# EasyEDA Pro project ProProject_Kame Quadrapot_2024-12-26.epro, board PCB1
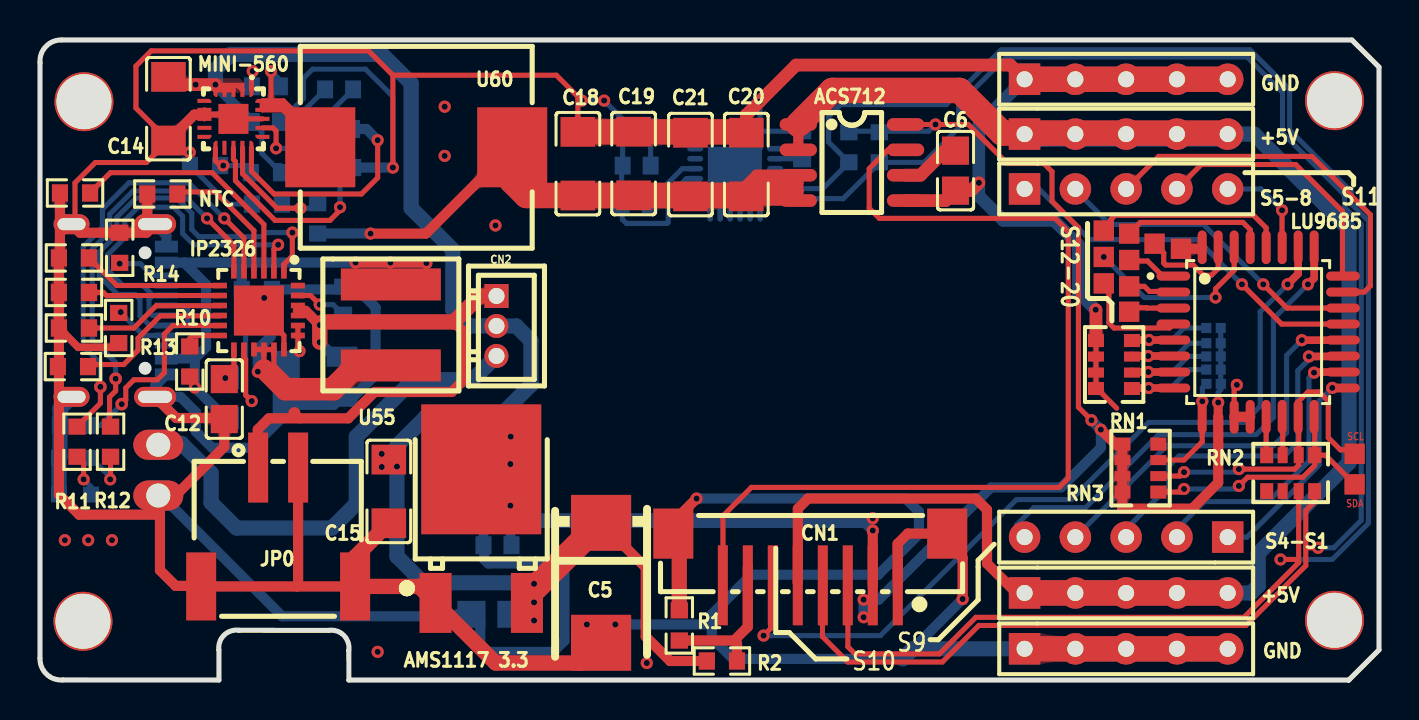
[diagram p7: board, top side]
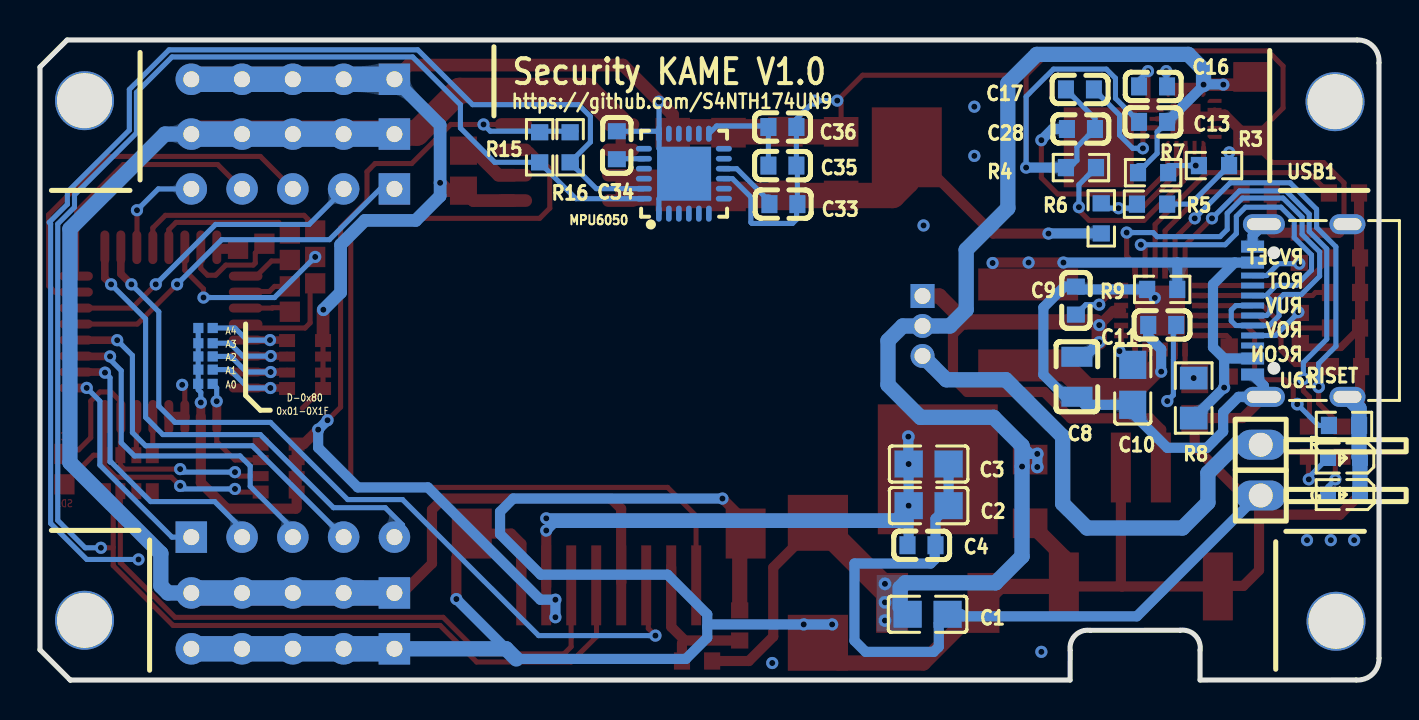
[diagram p8: board, bottom side, seen from below]

Outline 66.98 x 32.03 mm; copper layers: Top Layer, Bottom Layer. Coordinates in mm from the lower left corner of the outline.
Outline path: 65.47,0 15.45,0 15.45,1.49 arc(15.2,2.24) 14.45,2.49 9.95,2.49 arc(9.2,2.24) 8.95,1.49 8.95,0 1.14,0 arc(0.33,0.29) 0,1.09 0,30.89 arc(0.29,31.7) 1.09,32.03 65.62,32.03 66.98,30.67 66.98,1.51 65.47,0 ; 65.47,0 65.44,0
Stack: Top Layer 0.035mm / Dielectric1 1.51mm FR4 er 4.5 / Bottom Layer 0.035mm

## Design rules (mm)
template: Custom Config
spacing copperThickness1oz (default): track to track 0.102, other pairs 0.051 to 0.3
spacing copperThickness2oz: track to track 0.203, other pairs 0.152 to 0.3
track width copperThickness1oz (default): min 0.127, default 0.254, max 2.54
track width copperThickness2oz: min 0.203, default 0.254, max 2.54
differential pair differentialPair (default): width min 0.127, default 0.254, max 2.54; gap min 0.152, default 0.152
via viaSize (default): diameter min 0.5, default 0.61, max 10; hole min 0.3, default 0.305, max 6.299

## Placement (name value [footprint] x y rotation side)
+5V  -  [HDR-5X1/2.54]  54.33 4.36 0 top
+5V#2  -  [HDR-5X1/2.54]  54.33 27.32 0 top
ACS712  ACS712ELCTR-05B-T-JSM  [SOP-8_L4.9-W3.9-P1.27-LS6.0-BL]  40.61 25.9 270 top
AMS1117 3.3  AMS1117-3.3  [TO-252-3_L6.6-W6.1-P4.58-LS10.1-BR]  22.07 7.2 270 top
C1  106  [C0805]  22.58 3.29 0 bottom
C2  106  [C0805]  22.53 8.73 0 bottom
C3  106  [C0805]  22.53 10.81 0 bottom
C4  104  [C0603]  22.88 6.74 0 bottom
C5  33uF  [CASE-D_7343]  28.07 4.86 90 top
C6  1nF  [C0805]  45.8 25.49 270 top
C8  10uF  [C0805#2]  15.11 15.18 270 bottom
C9  0.1pF  [C0603]  15.16 18.99 270 bottom
C10  22uF  [C0805]  12.32 14.77 270 bottom
C11  100nF  [C0603]  10.84 17.77 180 bottom
C12  10uF  [C0805]  9.22 14.06 90 top
C13  10nF  [C0603]  11.3 27.93 180 bottom
C14  4.7uF  [C1206]  6.43 28.59 90 top
C15  4.7uF  [C1206]  17.45 9.44 90 top
C16  1nF  [C0603]  11.3 29.71 0 bottom
C17  1nF  [C0603]  14.96 29.55 0 bottom
C18  4.7uF  [C1206]  26.9 25.84 270 top
C19  4.7uF  [C1206]  29.69 25.84 270 top
C20  4.7uF  [C1206]  35.33 25.79 270 top
C21  4.7uF  [C1206]  32.54 25.79 270 top
C28  1nF  [C0603]  14.91 27.57 180 bottom
C33  1u  [C0603]  29.79 23.81 180 bottom
C34  1u  [C0603]  38.12 26.76 90 bottom
C35  10u  [C0603]  29.84 25.74 0 bottom
C36  1u  [C0603]  29.84 27.67 0 bottom
CN1  8PIN_SMT(1.25MM)  [CONN-SMD_8PIN_SMT-P1.25]  38.53 6.03 180 top
CN2  HDR-1X2  [CONN-TH_3P-P1.50_ZH1.5-3A]  22.83 17.72 270 top
G  LedRed_0603  [LED0603-RD_RED]  1.75 9.28 0 bottom
GND  -  [HDR-5X1/2.54]  54.33 1.56 0 top
GND#2  -  [HDR-5X1/2.54]  54.33 30.06 0 top
IP2326  IP2326_NPD  [QFN-24_L4.0-W4.0-P0.50-BL-EP2.5]  10.95 18.49 180 top
JP0  HDR-1X2  [CONN-SMD_PH2.0MM-2AWB]  11.91 7.66 0 top
LU9685  LU9685-20CU  [LQFP-32_L7.0-W7.0-P0.80-LS9.0-BL]  60.93 17.41 270 top
MINI-560  -  [VQFN-20_L3.0-W3.0-P0.45-TL-EP]  9.68 28.08 270 top
MPU6050  MPU6050-YJLTY  [QFN-24_L4.0-W4.0-P0.50-BL-EP2.7]  34.77 25.34 180 bottom
NOREF  -  [Pad_e2335]  53.21 21.17 180 top
NOREF#2  -  [Pad_e2310]  54.48 22.34 180 top
NOREF#3  -  [Pad_e13529]  59.06 15.53 180 top
NOREF#4  -  [Pad_e13526]  59.06 14.82 180 top
NOREF#5  -  [Pad_e13535]  59.06 17.62 180 top
NOREF#6  -  [Pad_e2339]  54.48 18.43 180 top
NOREF#7  -  [Pad_e13532]  58.34 16.85 180 top
NOREF#8  -  [Pad_e13533]  59.06 16.85 180 top
NOREF#9  -  [Pad_e13531]  59.06 16.19 180 top
NOREF#10  -  [Pad_e2297]  53.21 22.49 180 top
NOREF#11  -  [Pad_e2321]  55.75 21.83 180 top
NOREF#12  -  [Pad_e77]  64.75 28.99 0 top
NOREF#13  -  [Pad_e13530]  58.34 16.19 180 top
NOREF#14  -  [Pad_e2405]  12.72 13.35 0 top
NOREF#15  -  [Pad_e2336]  54.48 21.02 180 top
NOREF#16  -  [Pad_e2377]  65.76 11.32 180 top
NOREF#17  -  [Pad_e2337]  53.21 19.85 180 top
NOREF#18  -  [Pad_e73]  2.15 2.94 0 top
NOREF#19  -  [Pad_e2322]  57.07 21.58 180 top
NOREF#20  -  [Pad_e2338]  54.48 19.7 180 top
NOREF#21  -  [Pad_e13528]  58.34 15.53 180 top
NOREF#22  -  [Pad_e13534]  58.34 17.62 180 top
NOREF#23  -  [Pad_e71]  2.2 28.94 0 top
NOREF#24  -  [Pad_e2378]  65.76 9.79 180 top
NOREF#25  -  [Pad_e75]  64.75 2.99 0 top
NOREF#26  -  [Pad_e13525]  58.34 14.82 180 top
NTC  5.1kΩ  [R0603]  6.12 24.32 0 top
R  LedGreen_0603  [LED0603-RD_GREEN]  1.75 11.11 0 bottom
R1  10kΩ  [R0603]  31.98 2.73 90 top
R2  15kΩ  [R0603]  34.11 0.95 0 top
R3  5.1kΩ  [R0603]  8.25 25.74 0 bottom
R4  5.1kΩ  [R0603]  14.91 25.64 180 bottom
R5  8.1kΩ  [R0603]  11.35 23.81 0 bottom
R6  8.5kΩ  [R0603]  13.89 23.1 270 bottom
R7  5.1kΩ  [R0603]  11.3 25.39 180 bottom
R8  0.56  [R0805]  9.27 14.11 270 bottom
R9  5.1kΩ  [R0603]  10.84 19.55 180 bottom
R10  5.1kΩ  [R0603]  7.49 15.94 90 top
R11  1kΩ  [R0603]  1.85 11.93 90 top
R12  1kΩ  [R0603]  3.53 11.93 90 top
R13  5.1kΩ  [R0603]  3.94 17.62 90 top
R14  5.1kΩ  [R0603]  3.99 21.63 270 top
R15  2.2K  [R0603]  41.99 26.66 90 bottom
R16  2.2K  [R0603]  40.46 26.66 90 bottom
RCON  1k  [R0603]  1.65 15.68 0 top
RISET  75k  [R0603]  1.75 12.74 0 bottom
RN1  4.7kΩ  [RES-ARRAY-SMD_0603-8P-L3.2-W1.6-BL]  53.72 15.79 270 top
RN2  220Ω  [RES-ARRAY-SMD_0603-8P-L3.2-W1.6-BL]  62.56 10.35 0 top
RN3  4.7kΩ  [RES-ARRAY-SMD_0603-8P-L3.2-W1.6-BL]  55.04 10.6 270 top
ROT  120K  [R0603]  1.7 21.12 0 top
ROV  NC  [R0603]  1.7 17.62 0 top
RUV  1k  [R0603]  1.7 19.39 0 top
RVSET  NC  [R0603]  1.75 24.37 180 top
S4-S1  2.54mm 1*5p Female header  [HDR-5X1/2.54]  54.33 7.15 180 top
S5-8  2.54mm 1*5p Female header  [HDR-5X1/2.54]  54.33 24.57 0 top
U55  2.2uH  [IND-SMD_L6.7-W6.5]  17.55 17.77 90 top
U60  BCIHP1040SC-R15M  [IND-SMD_L11.6-W10.1]  18.82 26.66 0 top
U61  PH2.0-2P  [2.54mm_1*2P_oval]  5.92 9.23 0 bottom
USB1  TYPEC-304A-ACP16O  [USB-SMD_TYPEC-304A-ACP16O]  3.95 18.49 90 bottom

## Footprints (pads in the part's own frame, mm; a bottom-side part is the same pattern mirrored in y, then rotated)
2.54mm_1*2P_oval
  oval 2.5x1.5 hole 1.2: 1(0,0) 2(0,-2.54)
C0603
  rect 0.8x0.9 smd: 1(-0.7,0) 2(0.7,0)
C0805
  rect 1.41x1.35 smd: 1(-1,0) 2(1,0)
C0805#2
  rect 1x1.55 smd: 1(-1,0) 2(1,0)
C1206
  rect 1.485x1.728 smd: 1(-1.593,0) 2(1.593,0)
CASE-D_7343
  rect 2.799x3.01 smd: 1(3,0) 2(-3,0)
CONN-SMD_8PIN_SMT-P1.25
  rect 0.5x4 smd: 1(-4.375,1.295) 2(-3.125,1.295) 3(-1.875,1.295) 4(-0.625,1.295) 5(0.625,1.295) 6(1.875,1.295) 7(3.125,1.295) 8(4.375,1.295)
  rect 2x2.5 smd: 9(6.85,-1.295) 10(-6.85,-1.295)
CONN-SMD_PH2.0MM-2AWB
  rect 1x3.5 smd: 1(-1,2.975) 2(1,2.975)
  rect 1.5x3.4 smd: 3(3.85,-2.975) 4(-3.85,-2.975)
CONN-TH_3P-P1.50_ZH1.5-3A
  rect 1.2x1.2 hole 0.8: 1(-1.5,0)
  round 1.2 hole 0.8: 2(0.001,0) 3(1.5,0)
HDR-5X1/2.54
  rect 1.575x1.575 hole 0.8: 1(-5.08,0)
  round 1.575 hole 0.8: 2(-2.54,0) 3(0,0) 4(2.54,0) 5(5.08,0)
IND-SMD_L6.7-W6.5
  rect 1.6x5 smd: 1(-2.025,0) 2(2.025,0)
IND-SMD_L11.6-W10.1
  rect 3.5x4 smd: 1(-4.8,0) 2(4.8,0)
LED0603-RD_GREEN
  rect 0.8x0.8 smd: 1(-0.799,-0.004) 2(0.799,0.004)
LED0603-RD_RED
  rect 0.8x0.8 smd: 1(-0.799,-0.004) 2(0.799,0.004)
LQFP-32_L7.0-W7.0-P0.80-LS9.0-BL
  oval 0.448x1.684 smd: 1(-2.8,-4.242) 2(-2,-4.242) 3(-1.2,-4.242) 4(-0.4,-4.242) 5(0.4,-4.242) 6(1.2,-4.242) 7(2,-4.242) 8(2.8,-4.242) 17(2.8,4.242) 18(2,4.242) 19(1.2,4.242) 20(0.4,4.242) 21(-0.4,4.242) 22(-1.2,4.242) 23(-2,4.242) 24(-2.8,4.242)
  oval 1.684x0.448 smd: 9(4.242,-2.8) 10(4.242,-2) 11(4.242,-1.2) 12(4.242,-0.4) 13(4.242,0.4) 14(4.242,1.2) 15(4.242,2) 16(4.242,2.8) 25(-4.242,2.8) 26(-4.242,2) 27(-4.242,1.2) 28(-4.242,0.4) 29(-4.242,-0.4) 30(-4.242,-1.2) 31(-4.242,-2) 32(-4.242,-2.8)
Pad_e71
  round 2.95 hole 2.75: 1(0,0)
Pad_e73
  round 2.95 hole 2.75: 2(0,0)
Pad_e75
  round 2.95 hole 2.75: 4(0,0)
Pad_e77
  round 2.95 hole 2.75: 3(0,0)
Pad_e2297
  rect 1.016x1.016 smd: 6(0,0)
Pad_e2310
  rect 1.016x1.016 smd: 6(0,0)
Pad_e2321
  rect 1.016x1.016 smd: 6(0,0)
Pad_e2322
  rect 1.016x1.016 smd: 6(0,0)
Pad_e2335
  rect 1.016x1.016 smd: 6(0,0)
Pad_e2336
  rect 1.016x1.016 smd: 6(0,0)
Pad_e2337
  rect 1.016x1.016 smd: 6(0,0)
Pad_e2338
  rect 1.016x1.016 smd: 6(0,0)
Pad_e2339
  rect 1.016x1.016 smd: 6(0,0)
Pad_e2377
  rect 1.016x1.016 smd: 6(0,0)
Pad_e2378
  rect 1.016x1.016 smd: 6(0,0)
Pad_e2405
  round 0.61 smd: TP1(0,0)
Pad_e13525
  rect 0.508x0.508 smd far side: 6(0,0)
Pad_e13526
  rect 0.508x0.508 smd far side: 6(0,0)
Pad_e13528
  rect 0.508x0.508 smd far side: 6(0,0)
Pad_e13529
  rect 0.508x0.508 smd far side: 6(0,0)
Pad_e13530
  rect 0.508x0.508 smd far side: 6(0,0)
Pad_e13531
  rect 0.508x0.508 smd far side: 6(0,0)
Pad_e13532
  rect 0.508x0.508 smd far side: 6(0,0)
Pad_e13533
  rect 0.508x0.508 smd far side: 6(0,0)
Pad_e13534
  rect 0.508x0.508 smd far side: 6(0,0)
Pad_e13535
  rect 0.508x0.508 smd far side: 6(0,0)
QFN-24_L4.0-W4.0-P0.50-BL-EP2.5
  rect 0.28x0.7 smd: 1(-1.25,-1.95) 2(-0.75,-1.95) 3(-0.25,-1.95) 4(0.25,-1.95) 5(0.75,-1.95) 6(1.25,-1.95) 13(1.25,1.95) 14(0.75,1.95) 15(0.25,1.95) 16(-0.25,1.95) 17(-0.75,1.95) 18(-1.25,1.95)
  rect 0.7x0.28 smd: 7(1.95,-1.25) 8(1.95,-0.75) 9(1.95,-0.25) 10(1.95,0.25) 11(1.95,0.75) 12(1.95,1.25) 19(-1.95,1.25) 20(-1.95,0.75) 21(-1.95,0.25) 22(-1.95,-0.25) 23(-1.95,-0.75) 24(-1.95,-1.25)
  rect 2.5x2.5 smd: 25(0,0)
QFN-24_L4.0-W4.0-P0.50-BL-EP2.7
  oval 0.28x0.8 smd: 1(-1.25,-2) 2(-0.75,-2) 3(-0.25,-2) 4(0.25,-2) 5(0.75,-2) 6(1.25,-2) 13(1.25,2) 14(0.75,2) 15(0.25,2) 16(-0.25,2) 17(-0.75,2) 18(-1.242,2)
  oval 0.8x0.28 smd: 7(2,-1.25) 8(2,-0.75) 9(2,-0.25) 10(2,0.25) 11(2,0.75) 12(2,1.25) 19(-2,1.25) 20(-2,0.75) 21(-2,0.25) 22(-2,-0.25) 23(-2,-0.75) 24(-2,-1.25)
  rect 2.7x2.7 smd: 25(0.013,0)
R0603
  rect 0.806x0.864 smd: 1(-0.753,0) 2(0.753,0)
R0805
  rect 1.133x1.377 smd: 1(-1,0) 2(1,0)
RES-ARRAY-SMD_0603-8P-L3.2-W1.6-BL
  rect 0.65x0.8 smd: 1(-1.2,-0.9) 4(1.2,-0.9) 5(1.2,0.9) 8(-1.2,0.9)
  rect 0.5x0.8 smd: 2(-0.4,-0.9) 3(0.4,-0.9) 6(0.4,0.9) 7(-0.4,0.9)
SOP-8_L4.9-W3.9-P1.27-LS6.0-BL
  oval 0.63x1.865 smd: 1(-1.905,-2.683) 2(-0.635,-2.683) 3(0.635,-2.683) 4(1.905,-2.683) 5(1.905,2.683) 6(0.635,2.683) 7(-0.635,2.683) 8(-1.905,2.683)
TO-252-3_L6.6-W6.1-P4.58-LS10.1-BR
  rect 3x1.6 smd: 1(3.342,-2.285) 3(3.342,2.285)
  rect 6.5x6 smd: 2(-3.342,0)
USB-SMD_TYPEC-304A-ACP16O
  oval 1x2.1 hole 0.6x1.7: 12(-4.32,1.808) 13(4.32,1.808)
  oval 1x1.8 hole 0.6x1.4: 14(-4.32,-2.373) 15(4.32,-2.373)
  rect 0.6x1.15 smd: A1B12(-3.2,2.373) A4B9(-2.4,2.373) B1A12(3.2,2.373) B4A9(2.4,2.373)
  rect 0.3x1.15 smd: A5(-1.25,2.373) A6(-0.25,2.373) A7(0.25,2.373) A8(1.25,2.373) B5(1.75,2.373) B6(0.75,2.373) B7(-0.75,2.373) B8(-1.75,2.373)
VQFN-20_L3.0-W3.0-P0.45-TL-EP
  custom 0.7x0.2 smd: 1(-1.45,0.9) 2(-1.45,0.45) 3(-1.45,0) 4(-1.45,-0.45) 5(-1.45,-0.9) 11(1.45,-0.9) 12(1.45,-0.45) 13(1.45,0) 14(1.45,0.45) 15(1.45,0.9)
  custom 0.2x0.7 smd: 6(-0.9,-1.45) 7(-0.45,-1.45) 8(0,-1.45) 9(0.45,-1.45) 10(0.9,-1.45) 16(0.9,1.45) 17(0.45,1.45) 18(0,1.45) 19(-0.45,1.45) 20(-0.9,1.45)
  rect 1.5x1.5 smd: 21(0,0)

## Nets
+5V: ACS712.3 ACS712.4 C18.2 C19.2 C20.2 C21.2 R6.2 U60.2
DVCC: ACS712.8 AMS1117 3.3.2 C2.2 C3.2 C4.2 CN1.2 LU9685.10 NOREF#3.6 NOREF#4.6 NOREF#5.6 NOREF#8.6 NOREF#9.6 R15.2 R16.2 RN3.1 RN3.2 RN3.3 RN3.4
VIN: R8.2 R9.2 R10.1 U55.2 USB1.A4B9 USB1.B4A9
A0: LU9685.9 NOREF#26.6 RN3.7
A1: LU9685.8 NOREF#21.6 RN1.5
A2: LU9685.7 NOREF#13.6 RN1.6
A3: LU9685.6 NOREF#7.6 RN1.7
A4: LU9685.5 NOREF#22.6 RN1.8
BAT: C8.1 CN2.1 IP2326.21 IP2326.22 JP0.1 NOREF#14.TP1
BAT+: AMS1117 3.3.3 C1.2 C5.1 C13.2 C14.2 C15.2 CN2.2 MINI-560.2 MINI-560.3 MINI-560.4 MINI-560.5 R2.1 R7.1
BT_SENSE: CN1.7 R1.1 R2.2
CUR_SEN: ACS712.7 CN1.8
DJ0: LU9685.17 S4-S1.1
DJ1: LU9685.18 S4-S1.2
DJ2: LU9685.19 S4-S1.3
DJ3: LU9685.20 S4-S1.4
DJ4: LU9685.21 S5-8.1
DJ5: LU9685.22 S5-8.2
DJ6: LU9685.23 S5-8.3
DJ7: LU9685.24 S5-8.4
DJ8: LU9685.25 S4-S1.5
DJ9: CN1.6 LU9685.26
DJ10: LU9685.27 S5-8.5
DJ11: LU9685.28 NOREF#10.6
DJ12: LU9685.29 NOREF#2.6
DJ13: LU9685.30 NOREF.6
DJ14: LU9685.31 NOREF#11.6
DJ15: LU9685.32 NOREF#19.6
DJ16: LU9685.1 NOREF#15.6
DJ17: LU9685.2 NOREF#20.6
DJ18: LU9685.3 NOREF#6.6
DJ19: LU9685.4 NOREF#17.6
DM: IP2326.1 USB1.A7 USB1.B7
DP: IP2326.2 USB1.A6 USB1.B6
M5V: +5V.1 +5V.2 +5V.3 +5V.4 +5V.5 +5V#2.1 +5V#2.2 +5V#2.3 +5V#2.4 +5V#2.5 ACS712.1 ACS712.2 CN1.5
P_GND: ACS712.5 AMS1117 3.3.1 C1.1 C2.1 C3.1 C4.1 C5.2 C6.2 C8.2 C9.1 C10.2 C12.1 C13.1 C14.1 C15.1 C17.2 C18.1 C19.1 C20.1 C21.1 C28.2 C33.2 C34.2 C35.1 C36.1 CN1.1 CN1.9 CN1.10 G.1 GND.1 GND.2 GND.3 GND.4 GND.5 GND#2.1 GND#2.2 GND#2.3 GND#2.4 GND#2.5 IP2326.18 IP2326.25 JP0.2 JP0.3 JP0.4 LU9685.11 LU9685.12 MINI-560.7 MINI-560.8 MINI-560.18 MINI-560.21 MPU6050.1 MPU6050.9 MPU6050.18 MPU6050.25 NTC.1 R.1 R1.2 R3.1 R4.1 R5.1 R9.1 R13.1 R14.1 RCON.1 RISET.1 RN1.1 RN1.2 RN1.3 RN1.4 ROT.1 ROV.1 RUV.1 RVSET.2 U61.1 USB1.12 USB1.13 USB1.14 USB1.15 USB1.A1B12 USB1.B1A12
RXD: RN2.1
SCL: CN1.3 MPU6050.23 R16.1 RN2.3
SDA: CN1.4 MPU6050.24 R15.1 RN2.4
TXD: RN2.2
$1N2: LU9685.16 NOREF#24.6 RN2.5 RN3.5
$1N6832: LU9685.14 RN2.7
$1N6846: LU9685.13 RN2.8
$1N6878: LU9685.15 NOREF#16.6 RN2.6 RN3.6
$1N9487: C10.1 IP2326.19 IP2326.20
$1N9488: C9.2 IP2326.23
$1N9489: C11.2 IP2326.14
$1N9490: C11.1 IP2326.15 IP2326.16 IP2326.17 U55.1
$1N9492: C12.2 IP2326.13 R8.1
$1N9496: R14.2 USB1.B5
$1N9497: R13.2 USB1.A5
$1N9501: IP2326.4 NTC.2
$1N9502: IP2326.5 R11.2
$1N9503: IP2326.6 R12.2
$1N9504: R.2 R12.1
$1N9505: G.2 R11.1
$1N9508: IP2326.10 RCON.2
$1N9510: IP2326.8 RUV.2
$1N9511: IP2326.7 ROT.2
$1N9512: IP2326.11 RISET.2
$1N9513: IP2326.12 R10.2
$1N13576: IP2326.9 ROV.2
$1N15007: ACS712.6 C6.1
$1N15953: C16.1 MINI-560.1
$1N16123: C16.2 MINI-560.19 MINI-560.20 U60.1
$1N16296: C28.1 MINI-560.15
$1N16300: C17.1 MINI-560.17
$1N16482: MINI-560.14 R5.2 R6.1
$1N16575: MINI-560.13 R4.2
$1N16837: IP2326.3 RVSET.1
$1N19307: CN2.3 U61.2
$1N19423: MINI-560.11 R3.2 R7.2
$1N21802: C33.1 MPU6050.10
$1N21828: C34.1 MPU6050.20
$1N21877: C35.2 C36.2 MPU6050.13

Pads without a net: IP2326 24; MINI-560 6 9 10 12 16; MPU6050 2 3 4 5 6 7 8 11 12 14 15 16 17 19 21 22; NOREF#12 3; NOREF#18 2; NOREF#23 1; NOREF#25 4; RN3 8; USB1 A8 B8

## Via types
v1: diameter 0.61, hole 0.305, Top Layer to Bottom Layer, 81 vias
v2: diameter 0.635, hole 0.305, Top Layer to Bottom Layer, 12 vias

## Routing (per net, layer and track width the routed paths; a pad name or vN(x,y) marks a point on that pad's centre or on a via; arc(x,y) is an arc through that point)
+5V: length 37.8
  Top Layer w0.508: C20.2 35.54,23.99 ACS712.4 37.93,24.46 ; C20.2 35.59,24.46 ; C20.2 35.33,24.78 35.84,25.29 37.85,25.29 37.93,25.21 37.93,24.88 ; 37.93,24.46 37.93,24.88 ; 37.93,24.46 35.59,24.46 ; 37.93,24.88 36.01,24.88 35.59,24.46 ; U60.2 19.3,22.34 v1(16.53,22.34)
  Top Layer w1.27: U60.2 23.62,24.96 24.33,24.25 C18.2 35.29,24.25 C20.2
  Bottom Layer w0.508: R6.2 16.53,22.35 v1(16.53,22.34)
DVCC: length 105.8
  Top Layer w0.254: v1(52.59,13) 51.94,13.65 51.94,22.64 50.62,23.97 50.62,25.44 50.21,25.84 48.39,25.84 46.43,27.8 v1(44.79,27.8) ACS712.8
  Top Layer w0.508: LU9685.10 58.93,9.88 57.63,8.57 54.18,8.57 54.14,8.61 RN3.2 RN3.1 53.79,11.8 v1(53.06,12.53) ; v1(41.65,7.48) 41.65,4.69
  Bottom Layer w0.254: v1(58.93,13.89) 58.93,14.4 59.06,14.53 NOREF#4.6 59.06,17.61 NOREF#5.6 ; v1(44.79,27.8) 44.45,27.46 40.16,27.46
  Bottom Layer w0.508: v2(23.53,8.73) v2(23.53,10.81) 23.54,10.82 v2(23.54,12.18) ; v2(23.53,8.73) 23.53,7.86 ; v2(23.53,8.73) 24.16,8.09 v1(41.65,8.09) ; 23.53,7.86 41.27,7.86 v1(41.65,7.48) ; 23.53,7.86 23.53,6.9 23.69,6.74 ; v1(52.59,13) v1(53.06,12.53) 53.06,11.63 51.08,9.64 47.57,9.64 41.95,4.02 v1(41.2,4.02) v1(41.2,3.14)
VIN: length 24.9
  Top Layer w0.508: v1(19.33,20.87) 19.31,20.89 v1(17.53,20.89) v1(15.78,20.89)
  Bottom Layer w0.508: 10.08,20.89 10.09,20.88 R9.2 ; 10.08,20.89 v1(15.78,20.89) ; 10.08,20.89 7.21,20.89 ; 7.75,16.09 6.33,16.09 ; 7.75,16.09 v1(7.75,14.63) R8.2 ; 7.75,16.09 8.3,16.65 8.3,19.8 7.21,20.89 ; 7.21,20.89 USB1.B4A9
A0: length 5.6
  Top Layer w0.254: RN3.7 55.95,11.01 57.22,11.01 58.13,11.92 58.13,13.17 58.14,13.18 v1(58.14,13.95)
  Bottom Layer w0.254: v1(58.14,13.95) 58.14,14.62 NOREF#26.6
A1: length 5.3
  Top Layer w0.381: 54.62,14.64 54.65,14.61 v1(55.45,14.61) LU9685.8
  Bottom Layer w0.254: NOREF#21.6 57.48,15.53 56.56,14.61 v1(55.45,14.61)
A2: length 5.3
  Top Layer w0.381: LU9685.7 v1(55.44,15.41) 54.65,15.41 54.62,15.44
  Bottom Layer w0.254: NOREF#13.6 57.43,16.19 56.65,15.41 v1(55.44,15.41)
A3: length 5.3
  Top Layer w0.381: LU9685.6 v1(55.43,16.21) 54.65,16.21 54.62,16.24
  Bottom Layer w0.254: NOREF#7.6 57.48,16.85 56.84,16.21 v1(55.43,16.21)
A4: length 5.2
  Top Layer w0.381: 54.62,17.04 54.65,17.01 v1(55.47,17.01) LU9685.5
  Bottom Layer w0.254: NOREF#22.6 57.22,17.62 56.62,17.01 55.48,17.01 v1(55.47,17.01)
BAT: length 30.4
  Top Layer w0.254: IP2326.22 IP2326.21 ; NOREF#14.TP1 12.98,13.09
  Top Layer w0.508: v1(13.99,17.76) 13.28,18.47 12.9,18.47 ; 20.7,17.92 21.31,17.31 21.31,15.13 20.6,14.41 16.74,14.41 15.42,13.09 11.45,13.09 10.9,12.54 10.9,10.65 10.91,10.63
  Top Layer w0.762: CN2.1 22,19.22 20.7,17.92 14.15,17.92 v1(13.99,17.76) v1(13.99,16.9)
  Bottom Layer w0.508: C8.1 14.72,16.18 v1(13.99,16.9)
BAT+: length 81.2
  Top Layer w0.254: 9,29.76 9.98,29.76 9.98,29.68 MINI-560.2 ; 9,29.76 8.81,29.76 v1(8.78,29.79) MINI-560.5 ; 9,29.76 MINI-560.5 ; MINI-560.3 MINI-560.4 MINI-560.5
  Top Layer w0.508: C5.1 30.3,5.63 30.3,2.17 31.52,0.95 R2.1
  Top Layer w0.635: v1(8.78,29.79) v1(7.79,29.79) 6.81,29.79 C14.2
  Top Layer w1.27: C5.1 28.02,7.86 24.31,4.16
  Bottom Layer w0.254: C13.2 11.1,27.43 11.1,26.35 11.71,25.74 12.06,25.74
  Bottom Layer w0.508: C13.2 8.72,29.81 7.85,29.81 ; 17.86,11.72 17.45,11.32 v2(17.09,11.32) v2(17.09,10.66)
  Bottom Layer w0.762: CN2.2 23.82,17.72 24.56,16.98 24.56,14.77 22.94,13.14 19.28,13.14 17.86,11.72 v2(17.86,10.68) 17.86,6.19 19.18,4.86 23.7,4.86 23.95,4.61 23.95,3.66 C1.2 ; v1(8.78,29.79) 8.78,30.54 9.54,31.31 17.12,31.31 18.57,29.86 18.57,23.61 20.65,21.53 20.65,18.53 21.46,17.72 22.83,17.72
  vias: v2(24.71,4.81) v2(24.71,3.89) v2(24.71,2.98)
BT_SENSE: length 7.8
  Top Layer w0.508: 35.41,5.65 35.41,2.66 34.72,1.98 ; R2.2 34.86,1.83 34.72,1.98 ; 34.72,1.98 R1.1
CUR_SEN: length 48
  Top Layer w0.254: 43.3,26.53 42.42,26.53 41.48,25.59 41.48,23.61 41.99,23.1 50.77,23.1 51.43,22.44 51.43,10.1 50.98,9.64 35.58,9.64 34.16,8.22 34.16,5.2
DJ0: length 10.7
  Top Layer w0.254: v1(64.64,14.62) 64.65,14.61 LU9685.17
  Bottom Layer w0.254: S4-S1.1 60.37,7.15 63.98,10.76 63.98,13.96 v1(64.64,14.62)
DJ1: length 14.6
  Top Layer w0.381: v1(63.73,15.38) 63.76,15.41 LU9685.18
  Bottom Layer w0.254: 56.46,7.15 58.24,8.93 61.44,8.93 63.42,10.91 63.47,10.91 63.47,15.13 v1(63.73,15.38)
DJ2: length 17.8
  Top Layer w0.381: LU9685.19 65.16,16.19 v1(63.47,16.19)
  Bottom Layer w0.254: 53.92,7.15 56.46,9.69 56.46,10.71 56.97,11.21 62.25,11.21 62.91,11.88 62.91,15.48 63.47,16.04 v1(63.47,16.19)
DJ3: length 20.1
  Top Layer w0.381: LU9685.20 65.17,17.01 v1(63.12,17.01)
  Bottom Layer w0.254: 51.38,7.15 S4-S1.4 56.36,11.72 61.7,11.72 62.36,12.38 62.36,16.24 v1(63.12,17.01)
DJ4: length 18.7
  Top Layer w0.254: LU9685.21 62.11,17.81 v1(60.12,19.8)
  Bottom Layer w0.254: v1(60.12,19.8) 57.89,22.03 52.5,22.03 49.96,24.57 49.25,24.57
DJ5: length 15.9
  Top Layer w0.254: LU9685.22 62.38,18.61 v1(61.19,19.8)
  Bottom Layer w0.254: v1(61.19,19.8) 58.19,22.8 53.52,22.8 51.79,24.52 S5-8.2
DJ6: length 19.2
  Top Layer w0.254: S5-8.3 55.96,26.2 63.63,26.2 66.55,23.28 66.55,19.72 66.24,19.41 LU9685.23
DJ7: length 13
  Top Layer w0.254: LU9685.24 65.15,20.24 65.15,23.46 62.81,25.79 58.09,25.79 56.87,24.57
DJ8: length 25
  Top Layer w0.381: v1(63.42,19.8) 63.73,20.11 LU9685.25
  Bottom Layer w0.254: 48.84,7.15 48.84,7.76 49.71,8.62 52.3,8.62 55.96,12.28 60.83,12.28 61.7,13.14 61.7,18.07 v1(63.42,19.8)
DJ9: length 41.3
  Top Layer w0.254: 36.55,5.09 36.55,2.58 v1(36.19,2.22)
  Top Layer w0.381: LU9685.26 62.93,20.33 v1(62.41,19.8)
  Bottom Layer w0.254: v1(62.41,19.8) 61.03,18.43 61.03,13.7 60.22,12.89 55.45,12.89 51.59,9.03 48.84,9.03 42.04,2.22 v1(36.19,2.22)
DJ10: length 5
  Top Layer w0.254: 62.13,21.65 62.13,21.66 v1(62.13,23.51)
  Bottom Layer w0.254: v1(62.13,23.51) 61.06,24.57 S5-8.5
DJ11: length 9.6
  Top Layer w0.254: 53.57,22.54 53.57,23.05 53.77,23.25 60.7,23.25 61.33,22.62 LU9685.28
DJ12: length 7.3
  Top Layer w0.254: LU9685.29 60.53,22.54 60.17,22.9 55.04,22.9 NOREF#2.6
DJ13: length 9.3
  Top Layer w0.254: LU9685.30 59.73,20.5 58.8,19.57 v1(58.8,19.14)
  Bottom Layer w0.254: v1(58.8,19.14) 55.24,19.14 v1(53.21,21.17)
DJ14: length 5.3
  Top Layer w0.254: NOREF#11.6 56.21,21.38 56.21,20.87 56.31,20.77 57.68,20.77 58.19,20.26 58.6,20.26 58.93,20.59 LU9685.31
DJ15: length 1.1
  Top Layer w0.508: 58.13,21.65 58.06,21.58 NOREF#19.6
DJ16: length 2.5
  Top Layer w0.254: LU9685.1 56.15,20.21 55.4,20.97 54.53,20.97 NOREF#15.6
DJ17: length 2.3
  Top Layer w0.254: LU9685.2 56.66,19.44 55.5,19.44 55.24,19.7 NOREF#20.6
DJ18: length 2.3
  Top Layer w0.254: NOREF#6.6 54.69,18.63 55.35,18.63 55.36,18.61 LU9685.3
DJ19: length 5.5
  Top Layer w0.254: NOREF#17.6 53.47,19.6 53.47,17.87 53.72,17.62 56.49,17.62 LU9685.4
DM: length 23.7
  Top Layer w0.254: v1(12.62,22.39) 12.62,21.22 12.2,20.8 IP2326.1
  Bottom Layer w0.254: USB1.A7 7.16,18.74 7.39,18.51 7.39,17.97 7.16,17.74 USB1.B7 5.49,17.74 5,18.22 5,19.06 4.77,19.29 3.89,19.29 2.97,20.21 2.97,21.43 3.85,22.3 3.85,23.16 4.8,24.12 6.83,24.12 7.59,23.36 7.59,22.54 7.95,22.19 11.1,22.19 11.3,22.39 v1(12.62,22.39)
DP: length 18.8
  Top Layer w0.254: IP2326.2 11.7,21.57 v1(11.91,21.78)
  Bottom Layer w0.254: USB1.A6 5.62,18.24 5.45,18.41 5.45,19.04 5.65,19.24 ; 5.65,19.24 5.14,19.75 4.14,19.75 3.38,20.51 3.38,21.27 4.24,22.14 4.24,23 4.9,23.66 6.68,23.66 7.14,23.2 7.14,22.34 7.7,21.78 v1(11.91,21.78) ; 5.65,19.24 USB1.B6
M5V: length 102.6
  Top Layer w0.508: 37.9,4.91 37.91,4.92 37.91,8.57 38.42,9.08 46.81,9.08 47.37,8.52 47.37,5.83 48.84,4.36 ; 37.93,26.53 ACS712.1
  Top Layer w1.27: +5V#2.5 59.36,27.37 48.13,27.37 46,29.5 39.63,29.5 ACS712.1 ; +5V.5 +5V.3 +5V.2 49.25,4.36
  Bottom Layer w0.762: +5V.5 60.58,4.36 60.93,4.71 60.93,6.34 65.48,10.88 65.48,22.57 60.73,27.32 +5V#2.5
  Bottom Layer w1.27: +5V#2.5 +5V#2.3 +5V#2.2 49.25,27.32 ; 49.25,4.36 +5V.2 +5V.3 +5V.5
P_GND: length 402.8
  Top Layer w0.254: MINI-560.18 MINI-560.21 ; v1(17.65,25.64) 17.65,30.27 ; 17.65,30.27 16.43,31.48 5.56,31.48 4.8,30.72 4.8,28.62 C14.1 ; 17.65,30.27 25.83,30.27 26.9,29.19 C18.1 ; 52.82,17.04 52.82,14.64 53.86,13.6 ; MINI-560.7 MINI-560.8 ; IP2326.25 12.2,17.24 IP2326.18 ; LU9685.11 59.73,14.64 v1(59.87,14.77) ; C14.1 6.65,27 7.24,26.4 v1(7.49,26.4) ; C14.1 5.33,25.9 2.77,25.9 1.75,24.88 1.75,22.98 USB1.15
  Top Layer w0.305: MINI-560.21 9.46,28.3 8.23,28.3
  Top Layer w0.381: ROV.1 1.91,16.65 3.72,16.65 R13.1
  Top Layer w0.508: 42.9,4.76 42.9,6.82 43.41,7.33 44.92,7.33 46.15,6.1 v1(46.15,4.05) ; 12.86,4.68 12.91,4.73 12.91,10.63 ; 12.86,4.68 JP0.3 ; 12.86,4.68 8.37,4.68 8.34,4.71 6.78,4.71 6,5.49 6,8.27 ; USB1.15 2.01,22.38 R14.1 5.33,22.38 USB1.13 5.37,23.2 NTC.1 ; 8.23,28.3 7.72,28.3 C14.1 ; 6,8.27 6,9.3 6.85,9.3 9.22,11.67 C12.1 9.27,13.11 6.82,13.11 USB1.12 ; 6,8.27 1.96,8.27 0.95,9.29 ROV.1 RUV.1 ROT.1 1,21.17 RVSET.2 ; v1(32.84,9.08) 31.22,7.46 31.22,7.33 ; LU9685.12 LU9685.11
  Top Layer w0.635: 52.82,17.04 52.82,18.52 v1(52.81,18.53) ; C20.1 35.33,28.28 37.82,30.77 48.54,30.77 49.25,30.06 ; ACS712.5 45.3,23.99 C6.2 46.57,24.49 v1(46.96,24.88)
  Top Layer w0.762: R1.2 31.98,7.03 CN1.9 ; C15.1 15.76,6.16 JP0.3 18.96,4.68 AMS1117 3.3.1 22.79,0.85 27.05,0.85 C5.2
  Top Layer w1.27: C20.1 35.29,27.43 C18.1 ; GND.5 GND.3 GND.2 49.25,1.56 ; 49.25,30.06 GND#2.2 GND#2.3 GND#2.5
  Bottom Layer w0.254: 32.77,25.09 32.34,25.09 31.42,24.17 31.42,22.9 31.37,22.85 29.34,22.85 29.13,23.05 29.13,23.77 C33.2 ; C13.1 13.18,29.11 13.18,30.11 13.64,30.57 16.28,30.57 17.65,29.2 v1(17.65,25.64) ; 38.28,27.46 36.14,27.46 MPU6050.18 ; 36.02,23.34 36.02,24.07 MPU6050.25 36.01,26.59 MPU6050.18 ; v1(27.1,28.99) v1(28.22,28.99) 29.14,28.07 29.14,25.95 29.09,25.9 29.09,24.17 ; MPU6050.18 v1(36.01,28.94) ; R4.1 15.47,25.64 15.11,26 15.11,26.67 C28.2 14.21,28.1 C17.2 ; R5.1 9.43,23.81 R3.1 7.49,25.75 v1(7.49,26.4) 7.44,26.4 7.39,26.35
  Bottom Layer w0.508: USB1.13 6.32,22.24 USB1.B1A12 ; C3.1 C2.1 22.18,8.07 C4.1 22.22,6.7 22.22,6.03 22.43,5.83 26.24,5.83 26.24,1.97 25.68,1.41 22.27,1.41 22.02,1.66 22.02,2.85 C1.1 20.9,3.29 20.8,3.19 12.11,3.19 6,9.3 ; R9.1 15.02,19.55 C9.1 15.74,19.69 16.79,18.64 16.79,15.28 15.69,14.18 C8.2 14.71,13.77 C10.2 12.32,13.35 10.59,11.62 8.61,11.62 7.8,12.43 7.8,13.4 7.03,14.17 USB1.12 5.76,14.72 USB1.A1B12 ; 33.6,2.66 33.6,3.29 35.58,5.27 41.93,5.27 43.97,7.3 43.97,8.42 43.31,9.08 v1(32.84,9.08) ; 33.6,2.66 33.6,2.12 34.67,1.05 43.15,1.05 ; 33.6,2.66 33.49,2.78 v1(28.78,2.78) v1(27.35,2.78) ; v1(17.65,25.64) R4.1 ; v1(46.15,4.05) 43.66,1.56
  Bottom Layer w0.635: 49.25,30.06 46.96,27.78 v1(46.96,24.88) 46.96,24.22 48.18,23 50.72,23 51.94,21.78 51.94,19.39 v1(52.81,18.53)
  Bottom Layer w0.762: 49.25,1.56 43.66,1.56 43.15,1.05 ; USB1.14 1,13.59 RISET.1 1,11.16 0.95,11.12 0.95,9.29
  Bottom Layer w1.27: 49.25,1.56 GND.2 GND.3 GND.5 ; GND#2.5 GND#2.3 GND#2.2 49.25,30.06
  vias: v1(1.24,7) v1(2.41,7) v1(3.6,7) v1(11.21,19.12) v1(16.89,1.41) v1(20.24,28.69) v1(20.24,26.23) v1(22.78,22.75) v1(30.35,0.85)
SCL: length 92.4
  Top Layer w0.254: 62.96,5.87 62.8,6.03 v1(62.05,6.03) ; 62.96,5.87 RN2.3 ; 62.96,5.87 60.22,3.14 46.81,3.14 44.98,1.31 40.77,1.31 40.41,1.66 40.41,4.28
  Bottom Layer w0.254: R16.1 39.44,26.92 39.44,28.2 40.04,28.79 45.34,28.79 48.08,31.53 60.52,31.53 62.51,29.55 62.51,27.52 65.61,24.42 65.61,23.81 66.52,22.9 66.45,22.83 66.45,7.84 64.64,6.03 v1(62.05,6.03) ; MPU6050.23 39.15,24.59 40.16,25.59 40.16,25.96
SDA: length 88.8
  Top Layer w0.254: 39.14,4.3 39.14,2.17 40.41,0.9 45.13,0.9 46.96,2.73 60.32,2.73 63.31,5.73 63.31,6.65 ; 63.31,6.65 63.35,6.62 v1(63.93,6.62) ; 63.31,6.65 63.31,8.48 63.76,8.92 RN2.4
  Bottom Layer w0.254: 36.77,24.09 40.18,24.09 41.78,25.69 41.78,25.96 ; R15.1 44.23,25.9 45.95,27.62 45.95,28.79 48.34,31.18 60.37,31.18 62.15,29.4 62.15,27.37 65.25,24.27 65.25,23.66 66.09,22.82 66.09,7.99 64.72,6.62 v1(63.93,6.62)
$1N2: length 13.4
  Top Layer w0.254: v1(59.97,9.71) 60.4,10.15 63.17,10.15 63.76,10.74 63.76,11.25 ; v1(57.22,9.56) 57.07,9.41 55.94,9.41 ; 63.76,11.25 63.76,13.14 LU9685.16 ; 63.76,11.25 64.3,11.25 NOREF#24.6
  Bottom Layer w0.254: v1(59.97,9.71) 59.82,9.56 v1(57.22,9.56)
$1N6832: length 1.9
  Top Layer w0.254: 62.16,11.25 62.16,13.14 62.13,13.17
$1N6846: length 1.9
  Top Layer w0.254: LU9685.13 61.33,11.28 61.36,11.25
$1N6878: length 15.8
  Top Layer w0.254: v1(59.97,10.55) 62.76,10.55 62.96,10.75 62.96,13.14 LU9685.15 62.93,13.93 63.42,14.41 63.98,14.41 64.44,13.96 64.44,12.13 65.05,11.52 65.56,11.52 NOREF#16.6 ; v1(57.22,10.4) 57.03,10.2 55.94,10.2
  Bottom Layer w0.254: v1(57.22,10.4) 59.82,10.4 v1(59.97,10.55)
$1N9487: length 1.3
  Top Layer w0.254: IP2326.20 IP2326.19 12.9,16.54 v1(12.98,16.46)
$1N9488: length 2.7
  Top Layer w0.254: v1(13.99,18.78) 13.54,19.24 IP2326.23
  Bottom Layer w0.254: v1(13.99,18.78) 14.67,18.78 C9.2
$1N9489: length 6.7
  Top Layer w0.254: v1(10.59,13.96) 10.29,14.26 10.29,16.04 10.2,16.13 IP2326.14
  Bottom Layer w0.254: v1(10.59,13.96) 10.29,14.26 10.29,17.63 C11.2
$1N9490: length 16.4
  Top Layer w0.254: 16.25,16.04 15.5,16.04 14.45,14.99 12.45,14.99 11.7,15.74 IP2326.17 IP2326.16 ; IP2326.16 IP2326.15 ; IP2326.16 11.2,15.99
  Top Layer w1: 16.25,16.04 14.7,14.49 12.26,14.49 11.2,15.55
  Bottom Layer w0.508: v1(10.9,15.43) 10.9,16.55 11.54,17.2 C11.1
$1N9492: length 1.6
  Top Layer w0.254: IP2326.13 9.7,15.54 v1(9.27,15.11)
$1N9496: length 2.6
  Bottom Layer w0.254: v1(3.99,20.83) 5.03,20.83 5.62,20.24 USB1.B5
$1N9497: length 2.8
  Bottom Layer w0.254: 4.04,18.38 5.18,17.24 USB1.A5
  vias: v1(4.04,18.41)
$1N9501: length 6.7
  Top Layer w0.254: IP2326.4 10.7,22.48 8.76,24.42 6.98,24.42 NTC.2
$1N9502: length 22.6
  Top Layer w0.254: v2(3.02,14.67) 3.02,13.85 R11.2 ; IP2326.5 10.2,22.12 v1(9.22,23.1)
  Bottom Layer w0.254: v2(3.02,14.67) 3.02,15.84 2.16,16.7 2.16,21.68 3.12,22.64 3.12,23.56 4.44,24.88 7.44,24.88 v1(9.22,23.1)
$1N9503: length 20.8
  Top Layer w0.254: IP2326.6 9.7,21.76 v1(8.36,23.1) ; v2(3.78,15.08) 3.78,14.47 3.48,14.16 3.48,12.73 R12.2
  Bottom Layer w0.254: v2(3.78,15.08) 3.78,15.89 2.61,17.06 2.61,21.57 3.49,22.45 3.49,23.31 4.65,24.47 6.98,24.47 8.35,23.1 v1(8.36,23.1)
$1N9504: length 2.6
  Top Layer w0.254: R12.1 3.53,10.06 v1(3.51,10.04)
  Bottom Layer w0.254: v1(3.51,10.04) 3.51,10.15 R.2
$1N9505: length 2.2
  Top Layer w0.254: R11.1 2.18,10.84 v1(2.18,10.04)
  Bottom Layer w0.254: v1(2.18,10.04) 2.55,9.67 G.2
$1N9508: length 7.9
  Top Layer w0.254: IP2326.10 8.99,18.22 6.02,18.22 4.9,17.11 4.9,16.5 4.19,15.79 2.45,15.79
$1N9510: length 6.6
  Top Layer w0.254: RUV.2 3.17,19.39 3.33,19.24 9,19.24
$1N9511: length 7.1
  Top Layer w0.254: ROT.2 3.83,19.74 IP2326.7
$1N9512: length 10.1
  Top Layer w0.254: IP2326.11 6.65,17.74 6.22,17.31 6.22,15.38 5.87,15.02 4.7,15.02 4.29,14.62 4.29,14.01 v2(4.09,13.81)
  Bottom Layer w0.254: v2(4.09,13.81) 3.02,12.74 RISET.2
$1N9513: length 2
  Top Layer w0.254: R10.2 7.49,17.1 7.63,17.24 IP2326.12
$1N13576: length 7
  Top Layer w0.254: IP2326.9 8.99,18.73 5.82,18.73 4.7,17.62 ROV.2
$1N15007: length 3
  Top Layer w0.635: ACS712.6 44.04,25.26 45.27,26.49 C6.1
$1N15953: length 1.7
  Top Layer w0.254: v1(10.64,30.47) 10.58,30.4 MINI-560.1
  Bottom Layer w0.254: 10.65,29.71 10.65,30.46 v1(10.64,30.47)
$1N16123: length 13.8
  Top Layer w0.254: 11.5,28.98 11.56,29.03 v1(11.56,30.47) ; 11.5,28.98 12.18,28.98 14.02,27.14 U60.1 ; 11.5,28.98 11.5,28.74 ; 11.5,28.98 MINI-560.20 MINI-560.19 12.15,28.53 13.56,27.11
  Top Layer w0.305: 11.3,28.74 12.06,28.74 13.56,27.24 13.56,26.61
  Bottom Layer w0.254: 12.05,29.71 12.05,29.97 v1(11.56,30.47)
$1N16296: length 11.7
  Top Layer w0.254: v1(16.89,27.01) 16.89,25.13 16.08,24.32 11.71,24.32 10.58,25.45 MINI-560.15
  Bottom Layer w0.508: v1(16.89,27.01) 16.33,27.57 C28.1
$1N16300: length 5.9
  Top Layer w0.254: MINI-560.17 11.65,27.63 11.81,27.47 v1(11.81,26.61)
  Bottom Layer w0.254: v1(11.81,26.61) 12.32,26.61 12.98,27.27 12.98,28.27 C17.1
$1N16482: length 6.9
  Top Layer w0.254: MINI-560.14 10.13,26.62 10.13,25.34 11.86,23.61 v1(13.03,23.61)
  Bottom Layer w0.254: R6.1 13.65,23.61 v1(13.03,23.61) 12.31,23.61 R5.2
$1N16575: length 10.4
  Top Layer w0.254: MINI-560.13 9.68,26.05 9.78,25.95 9.78,24.98 11.76,23 14.5,23 15.01,23.51 v1(15.01,23.66)
  Bottom Layer w0.254: v1(15.01,23.66) 15.01,24.79 R4.2
$1N16837: length 12.5
  Top Layer w0.254: RVSET.1 3.52,25.39 8.61,25.39 11.2,22.8 IP2326.3
$1N19307: length 25
  Bottom Layer w0.762: CN2.3 21.64,15.02 18.67,15.02 15.82,12.18 15.82,8.83 14.6,7.61 9.83,7.61 8.56,8.88 8.56,10.36 7.08,11.84 6,11.84
$1N19423: length 2.5
  Top Layer w0.254: MINI-560.11 8.78,25.98 9.02,25.74 v1(9.17,25.74)
  Bottom Layer w0.254: v1(9.17,25.74) 10.55,25.74
$1N21802: length 2.9
  Bottom Layer w0.254: MPU6050.10 32.13,25.59 30.71,24.17 30.49,24.17
$1N21828: length 1.5
  Bottom Layer w0.254: 38.28,26.06 38.25,26.09 36.77,26.09
$1N21877: length 4.9
  Bottom Layer w0.254: 30.54,25.95 30.54,27.72 33.13,27.72 MPU6050.13

## Copper pours and planes (outline as drawn; the poured copper is in the pictures)
BAT+ on Top Layer: 8.72,30.11 10.23,30.11 10.23,29.38 8.72,29.38
BAT+ on Bottom Layer: 23.6,5.25 25.12,5.25 25.12,2.43 23.6,2.43
P_GND on Top Layer: -1.3,32.91 49.37,32.91 51.03,31.25 51.03,30.27 49.05,30.27 48.39,30.92 48.39,31.03 38.12,31.03 38.07,31.08 34.11,27.11 25.37,27.11 25.27,27.22 25.27,7.91 25.37,7.81 27.71,7.81 30.4,5.12 30.4,2.38 31.42,1.36 32.55,1.36 32.94,0.96 32.94,-1.18 -2.21,-1.18 -2.21,31.99
P_GND on Bottom Layer: -2.26,33.21 68.3,33.21 68.3,-2.2 -1.8,-2.2 -2.72,-1.28 -2.72,32.75

Small or netless copper shapes (teardrops, artwork), in the pictures only: 208 on Top Layer, 92 on Bottom Layer

## Text on the board
Bottom Silkscreen Layer: D-0x80 | 0x01-0X1F | A2 | A4 | A3 | A1 | A0 | https://github.com/S4NTH174UN9 | Security KAME V1.0
Top Layer: SDA | SCL
Top Silkscreen Layer: S11 | S12-20 | S10 | S9
